# Altium schematic sheet LED Matrix.SchDoc
size A; SheetNumber: 2; SheetTotal: 2
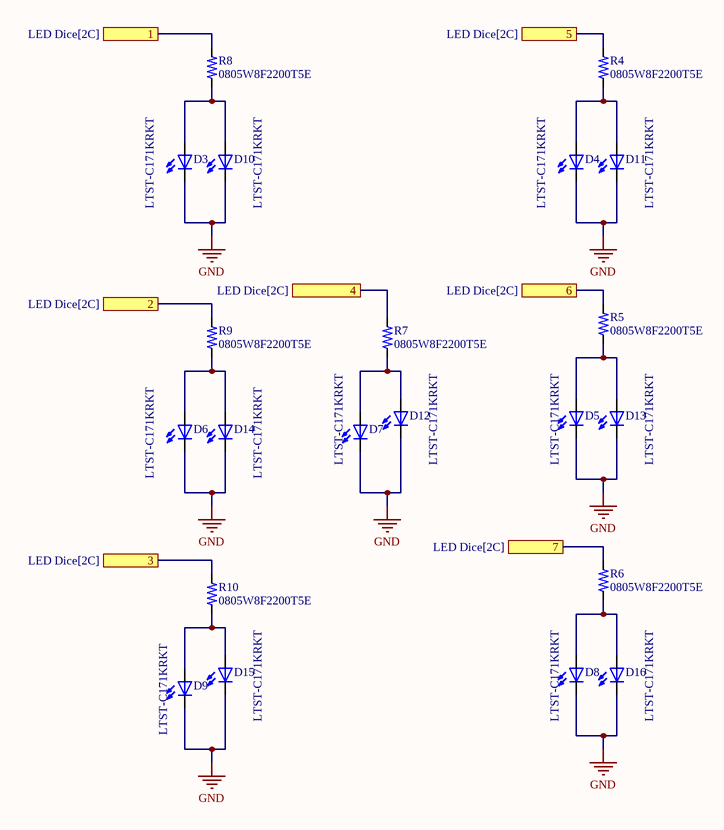
[diagram p0: LED Matrix.SchDoc]

## Parts
D3  LTST-C171KRKT  [DIOC200X125X110]
D4  LTST-C171KRKT  [DIOC200X125X110]
D5  LTST-C171KRKT  [DIOC200X125X110]
D6  LTST-C171KRKT  [DIOC200X125X110]
D7  LTST-C171KRKT  [DIOC200X125X110]
D8  LTST-C171KRKT  [DIOC200X125X110]
D9  LTST-C171KRKT  [DIOC200X125X110]
D10  LTST-C171KRKT  [DIOC200X125X110]
D11  LTST-C171KRKT  [DIOC200X125X110]
D12  LTST-C171KRKT  [DIOC200X125X110]
D13  LTST-C171KRKT  [DIOC200X125X110]
D14  LTST-C171KRKT  [DIOC200X125X110]
D15  LTST-C171KRKT  [DIOC200X125X110]
D16  LTST-C171KRKT  [DIOC200X125X110]
R4  0805W8F2200T5E  [RESC2012X65N]
R5  0805W8F2200T5E  [RESC2012X65N]
R6  0805W8F2200T5E  [RESC2012X65N]
R7  0805W8F2200T5E  [RESC2012X65N]
R8  0805W8F2200T5E  [RESC2012X65N]
R9  0805W8F2200T5E  [RESC2012X65N]
R10  0805W8F2200T5E  [RESC2012X65N]

## Ports
1 (see LED Dice[2C]), 2 (see LED Dice[2C]), 3 (see LED Dice[2C]), 4 (see LED Dice[2C]), 5 (see LED Dice[2C]), 6 (see LED Dice[2C]), 7 (see LED Dice[2C])

## Nets
GND: D3.NEG D4.NEG D5.NEG D6.NEG D7.NEG D8.NEG D9.NEG D10.NEG D11.NEG D12.NEG D13.NEG D14.NEG D15.NEG D16.NEG
1: R8.2 ; port 1
2: R9.2 ; port 2
3: R10.2 ; port 3
4: R7.2 ; port 4
5: R4.2 ; port 5
6: R5.2 ; port 6
7: R6.2 ; port 7
NetD3_POS: D3.POS D10.POS R8.1
NetD4_POS: D4.POS D11.POS R4.1
NetD5_POS: D5.POS D13.POS R5.1
NetD6_POS: D6.POS D14.POS R9.1
NetD7_POS: D7.POS D12.POS R7.1
NetD8_POS: D8.POS D16.POS R6.1
NetD9_POS: D9.POS D15.POS R10.1

## Library data of the parts
D3-D16 = LTST-C171KRKT: Red LED  0805 _2012 Indication 631nm - Discrete 2V 0805 _2012 Metric_; MF: Lite-On Inc.; MP: LTST-C171KRKT; Package: 0805 Lite-On; Price: None; Availability: Unavailable; SnapEDA_Link: https://www.snapeda.com/parts/LTST-C171KRKT/Lite-On%20Inc./view-part/357775/?ref=snap; Value: *
R4-R10 = 0805W8F2200T5E: 220Ω 0805 125mW Thick Film Resistors 150V ±100ppm/℃ ±1%  Chip Resistor - Surface Mount ROHS